# Altium schematic sheet Power.SchDoc
size A4; SheetNumber: 4; SheetTotal: 6
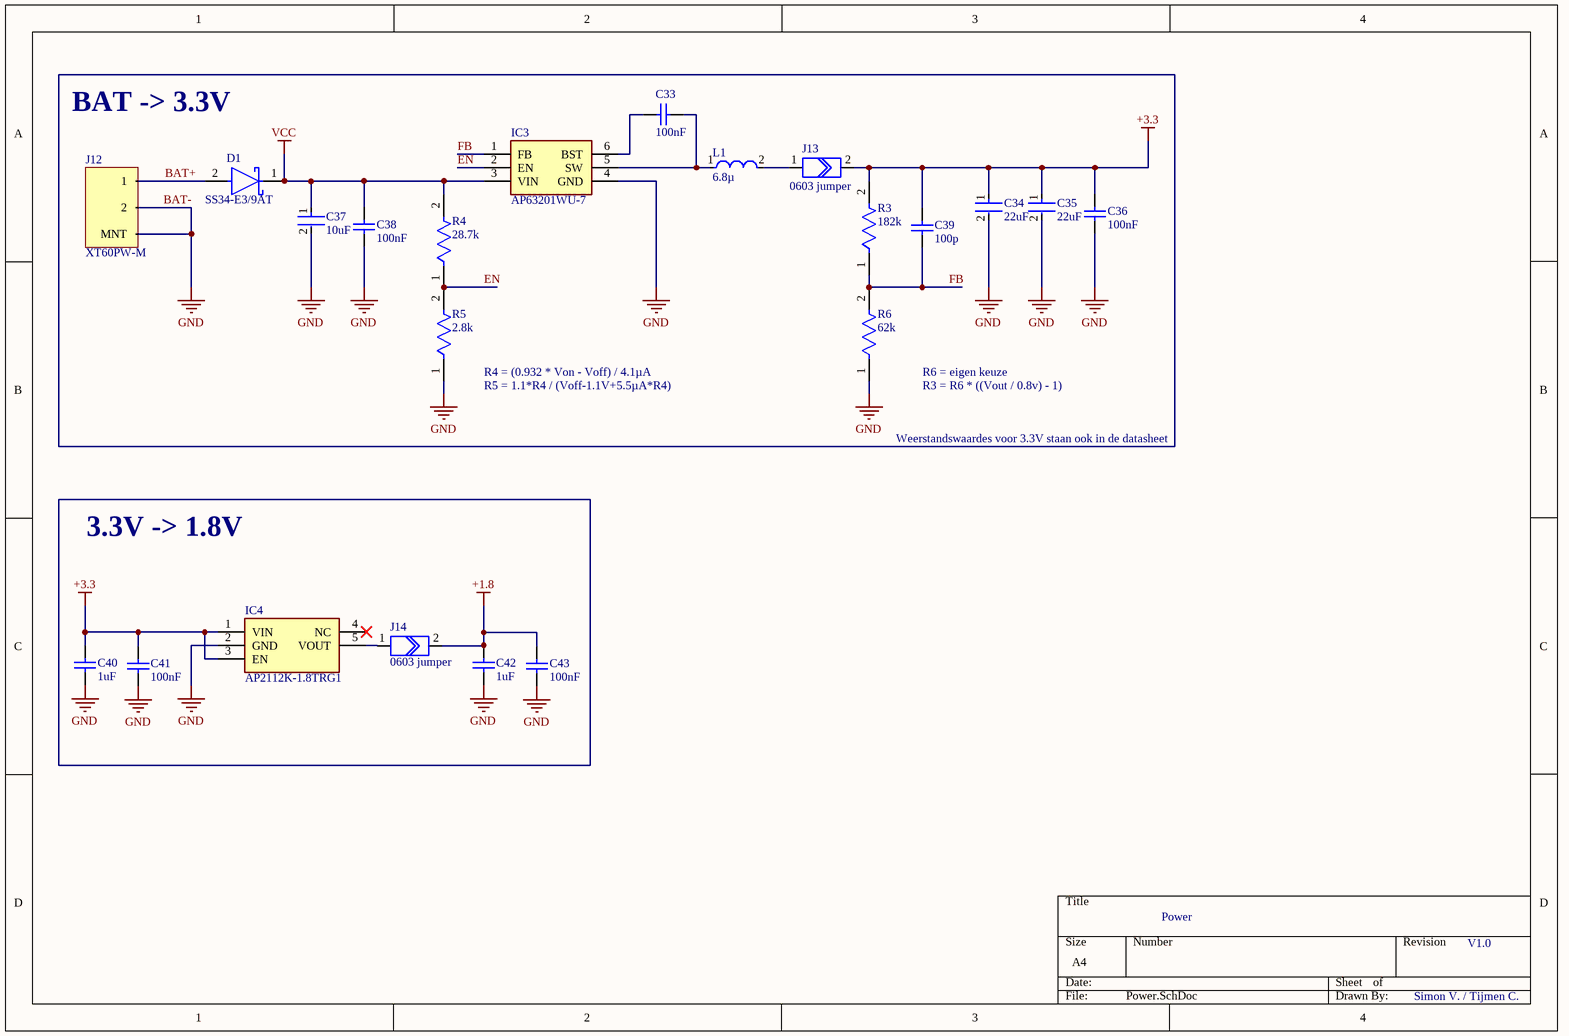
[diagram p0: Power.SchDoc]

## Parts
C33  100nF  [CAPC1608X92X38ML15T08]
C34  22uF  [FP-GRM188-0_2-IPC_A]
C35  22uF  [FP-GRM188-0_2-IPC_A]
C36  100nF  [CAPC1608X92X38ML15T08]
C37  10uF  [FP-ZRB18AR61E106ME01L-MFG]
C38  100nF  [CAPC1608X92X38ML15T08]
C39  100p  [CAPC1608X92X38LL15T08]
C40  1uF  [CAPC1608X90X35NL15T15]
C41  100nF  [CAPC1608X92X38ML15T08]
C42  1uF  [CAPC1608X90X35NL15T15]
C43  100nF  [CAPC1608X92X38ML15T08]
D1  SS34-E3/9AT  [FP-SMC-MFG]
IC3  AP63201WU-7  [SOT95P280X100-6N]
IC4  AP2112K-1.8TRG1  [SOT95P285X140-5N]
J12  XT60PW-M  [XT60 juist]
J13  0603 jumper  [0603 jumper]
J14  0603 jumper  [0603 jumper]
L1  6.8µ  [FP-MLZ1608-IPC_B]
R3  182k  [FP-AC0603-IPC_B]
R4  28.7k  [FP-TFCR0603-MFG]
R5  2.8k  [FP-CRCW0603-HPe3-IPC_B]
R6  62k  [FP-RMCF0603-IPC_B]

## Nets
+1.8: C42.2 C43.1 J14.2
+3.3: C34.1 C35.1 C36.2 C39.2 C40.2 C41.1 IC4.1(VIN) IC4.3(EN) J13.2 R3.2
BAT-: C34.2 C35.2 C36.1 C37.2 C38.1 C40.1 C41.2 C42.1 C43.2 IC3.4(GND) IC4.2(GND) J12.2 J12.MNT R5.1 R6.1  [also labelled GND]
VCC: C37.1 C38.2 D1.1(C) IC3.3(VIN) R4.2
BAT+: D1.2(A) J12.1
EN: IC3.2(EN) R4.1 R5.2
FB: C39.1 IC3.1(FB) R3.1 R6.2
NetC33_1: C33.1 IC3.5(SW) L1.1
NetC33_2: C33.2 IC3.6(BST)
NetIC4_5: IC4.5(VOUT) J14.1
NetJ13_1: J13.1 L1.2

Not connected (* = marked no-connect by the designer): IC4 4(NC)*

## Notes on the sheet
- BAT -> 3.3V
- (near R5) R4 = (0.932 * Von - Voff) / 4.1µA
- R6 = eigen keuze
- (near R5) R5 = 1.1*R4 / (Voff-1.1V+5.5µA*R4)
- Weerstandswaardes voor 3.3V staan ook in de datasheet
- R3 = R6 * ((Vout / 0.8v) - 1)
- 3.3V -> 1.8V
- Power
- V1.0
- Simon V. / Tijmen C.

## Library data of the parts
C33 C36 C38 C41 C43 = CMP-2006-01140-1: Part Number: VJ0603Y104MXXAC; Manufacturer: Vitramon
C34 C35 = CMP-06035-063651-1: Multilayer Ceramic Capacitor 22uF 20% 16V X5R 0603 Paper T/R
C37 = CMP-06035-062385-2: CAP CER 10UF 25V X5R 0603; Tolerance: 20%; Min Operating Temperature: -55°C; Voltage: 25V; Case Code (Imperial): 0603; Case Code (Metric): 1608; Voltage Rating (DC): 25V; Max Operating Temperature: 85°C; Depth: 0.8mm; Thickness: 0.047inch; RoHS Compliant: Yes; Dielectric: X5R; Mount: Surface Mount; Voltage Rating: 25V; Length: 0.063inch; Height: 1mm; Packaging: Cut Tape; Capacitance: 10uF; REACH SVHC: No SVHC; Width: 0.031inch; Case/Package: 0603
C39 = CMP-2006-01182-1: Manufacturer: Vitramon; Part Number: VJ0603A101FXAAC
C40 C42 = CMP-2006-04534-1: Part Number: 0603YD105MAT2A; Manufacturer: AVX Interconnect / Elco
D1 = CMP-02539-000066-1: DIODE SCHOTTKY 40V 3A DO214AB; Peak Non-Repetitive Surge Current: 100A; Forward Voltage: 500mV; Element Configuration: Single; Max Reverse Current: 500uA; Case/Package: SMC; Radiation Hardening: No; Series: -; Max Surge Current: 100A; RoHS Compliant: Yes; Min Operating Temperature: -55°C; Average Rectified Current: 3A; Max Reverse Leakage Current: 500uA; Package Quantity: 3500; Max Reverse Voltage (DC): 40V; Forward Current: 3A; Packaging: Tape and Reel; Max Operating Temperature: 125°C; Max Repetitive Reverse Voltage (Vrrm): 40V; Number of Pins: 2; Mount: Surface Mount
IC3 = AP63201WU-7: Integrated Circuit; Manufacturer_Name: Diodes Incorporated; Datasheet Link: https://www.diodes.com//assets/Datasheets/AP63200-AP63201-AP63203-AP63205.pdf; Height: 1mm; Manufacturer_Part_Number: AP63201WU-7; Mouser Part Number: 621-AP63201WU-7; Mouser Price/Stock: https://www.mouser.co.uk/ProductDetail/Diodes-Incorporated/AP63201WU-7?qs=u16ybLDytRaVD%252BU3eG30NA%3D%3D; Arrow Part Number: AP63201WU-7; Arrow Price/Stock: https://www.arrow.com/en/products/ap63201wu-7/diodes-incorporated?utm_currency=USD&region=nac
IC4 = AP2112K-1.8TRG1: Integrated Circuit; Manufacturer_Name: Diodes Incorporated; Datasheet Link: https://www.diodes.com//assets/Datasheets/AP2112.pdf; Height: 1.4mm; Manufacturer_Part_Number: AP2112K-1.8TRG1; Mouser Part Number: 621-AP2112K-1.8TRG1; Mouser Price/Stock: https://www.mouser.co.uk/ProductDetail/Diodes-Incorporated/AP2112K-1.8TRG1?qs=x6A8l6qLYDBx1xhw8AX2cw%3D%3D; Arrow Part Number: AP2112K-1.8TRG1; Arrow Price/Stock: https://www.arrow.com/en/products/ap2112k-1.8trg1/diodes-incorporated?utm_currency=USD&region=nac
L1 = CMP-08253-000236-1: Shielded Multilayer Inductor 6.8uH ±20% 300mA 962mΩ SMD 0603; RoHS Compliant: Yes
R3 = CMP-03412-027023-2: RES 182KΩ 1.00% 0.1W 0603; Resistance: 182kR; Max Power Dissipation: 100mW; Temperature Coefficient: 100ppm/°C; Tolerance: 1%; Height: 0.022inch; Width: 0.031inch; Case/Package: 0603; Features: Moisture Resistant; Max Operating Temperature: 155°C; Series: AC; Length: 0.063inch; RoHS Compliant: Yes; Resistor Type: Thick Film; Min Operating Temperature: -55°C; Packaging: Tape and Reel; Number of Terminations: 2
R4 = CMP-250906-245084-1: RES Thin Film,  28.7kΩ, 0.1%, 0.1W, 25ppm/°C, 0603
R5 = CMP-02407-011340-1: RES Thick Film, 2.8kΩ, 1%, 0.33W, 100ppm/°C, 0603; Resistance: 2.8kR; Max Power Dissipation: 250mW; Packaging: Tape and Reel; RoHS Compliant: Yes; Width: 0.033inch; Case Code (Metric): 1608; Lead Free: Lead Free; Radiation Hardening: No; Case Code (Imperial): 0603; Temperature Coefficient: 100ppm/°C; Case/Package: 0603; Features: Automotive AEC-Q200; Number of Terminations: 2; Max Operating Temperature: 155°C; Series: CRCW-HP; Min Operating Temperature: -55°C; Mount: Surface Mount; Resistor Type: Thick Film; Power Rating: 250mW; Package Quantity: 10; Length: 0.063inch; Tolerance: 1%; Contact Plating: Tin; Height: 0.022inch
R6 = CMP-26527-001234-1: 62kΩ ±5% 0.1W 0603 Thick Film Chip Resistor AEC-Q200 compliant; Resistance: 62kR; Max Power Dissipation: 100mW; Temperature Coefficient: 200ppm/°C; Case Code (Metric): 1608; RoHS Compliant: Yes; Size Code: 0603; Height: 0.022inch; Features: Automotive AEC-Q200; Radiation Hardening: No; Tolerance: 5%; Number of Terminations: 2; Packaging: Tape and Reel; Mount: Surface Mount; Power Rating: 100mW; Case/Package: 0603; Length: 0.061inch; Max Operating Temperature: 155°C; Width: 0.031inch; Min Operating Temperature: -55°C; Contact Plating: Tin; Package Quantity: 5000; Lead Free: Lead Free; Series: RMCF; Case Code (Imperial): 0603; Resistor Type: Thick Film